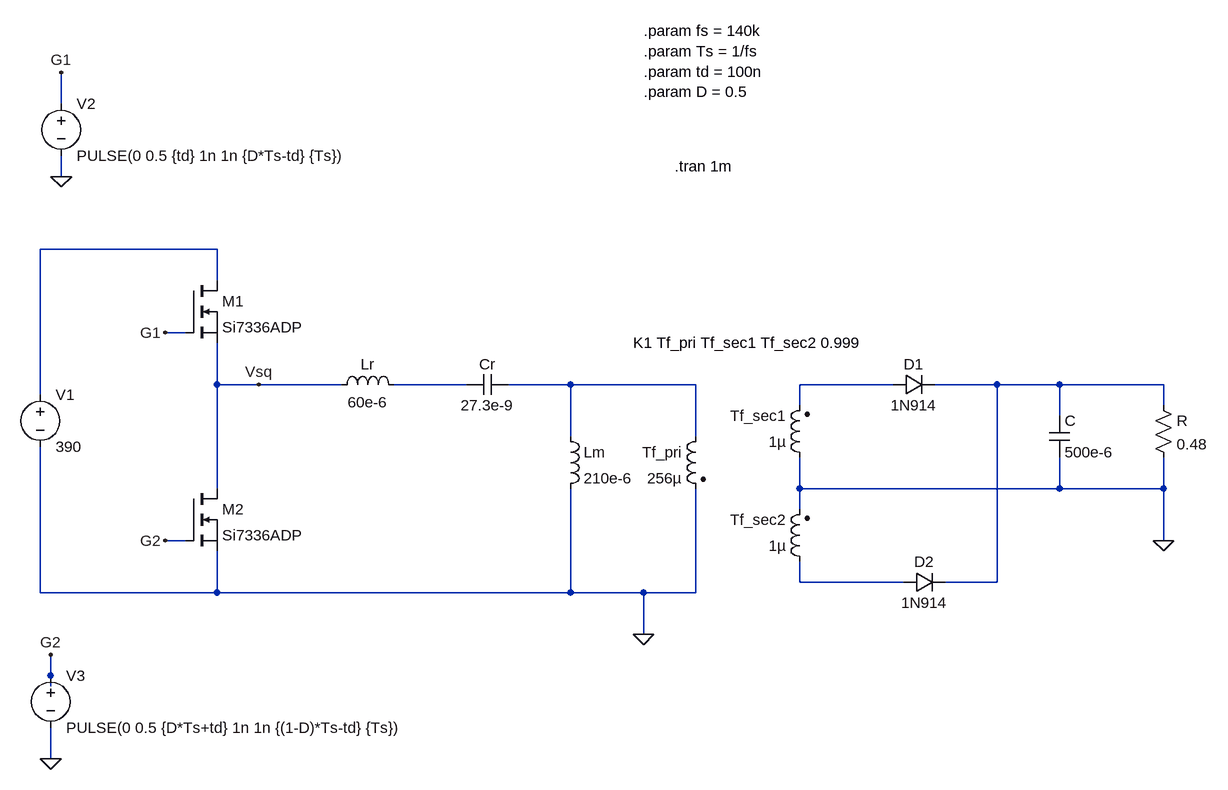
[diagram p0: schematic HalfBridge_LLC_TI.asc]
HalfBridge_LLC_TI.asc, the LTspice schematic file:
Version 4
SHEET 1 1708 728
WIRE -64 -320 -64 -368
WIRE -64 -208 -64 -240
WIRE 176 -96 -96 -96
WIRE 176 -48 176 -96
WIRE 128 32 96 32
WIRE 176 112 176 48
WIRE 240 112 176 112
WIRE 368 112 240 112
WIRE 560 112 448 112
WIRE 720 112 624 112
WIRE 912 112 720 112
WIRE 1216 112 1072 112
WIRE 1376 112 1280 112
WIRE 1472 112 1376 112
WIRE 1632 112 1472 112
WIRE -96 128 -96 -96
WIRE 1072 144 1072 112
WIRE 1632 144 1632 112
WIRE 1472 160 1472 112
WIRE 720 192 720 112
WIRE 912 192 912 112
WIRE 176 272 176 112
WIRE 1072 272 1072 224
WIRE 1472 272 1472 224
WIRE 1472 272 1072 272
WIRE 1632 272 1632 224
WIRE 1632 272 1472 272
WIRE 1072 304 1072 272
WIRE 128 352 96 352
WIRE 1632 352 1632 272
WIRE 1072 416 1072 384
WIRE 1232 416 1072 416
WIRE 1376 416 1376 112
WIRE 1376 416 1296 416
WIRE -96 432 -96 208
WIRE 176 432 176 368
WIRE 176 432 -96 432
WIRE 720 432 720 272
WIRE 720 432 176 432
WIRE 832 432 720 432
WIRE 912 432 912 272
WIRE 912 432 832 432
WIRE 832 496 832 432
WIRE -80 560 -80 528
WIRE -80 576 -80 560
WIRE -80 688 -80 640
FLAG 832 496 0
FLAG 1632 352 0
FLAG -64 -208 0
FLAG 96 32 G1
FLAG 96 352 G2
FLAG -64 -368 G1
FLAG -80 528 G2
FLAG -80 688 0
FLAG 240 112 Vsq
SYMBOL voltage -96 112 R0
WINDOW 123 0 0 Left 0
WINDOW 39 0 0 Left 0
SYMATTR InstName V1
SYMATTR Value 390
SYMBOL ind 352 128 R270
WINDOW 0 32 56 VTop 2
WINDOW 3 4 56 VBottom 2
SYMATTR InstName Lr
SYMATTR Value 60e-6
SYMBOL ind 704 176 R0
SYMATTR InstName Lm
SYMATTR Value 210e-6
SYMBOL ind2 928 176 M0
SYMATTR InstName Tf_pri
SYMATTR Value 256µ
SYMATTR Type ind
SYMBOL cap 560 128 R270
WINDOW 0 32 32 VTop 2
WINDOW 3 0 32 VBottom 2
SYMATTR InstName Cr
SYMATTR Value 27.3e-9
SYMBOL ind2 1088 240 R180
WINDOW 0 36 80 Left 2
WINDOW 3 36 40 Left 2
SYMATTR InstName Tf_sec1
SYMATTR Value 1µ
SYMATTR Type ind
SYMBOL ind2 1088 400 R180
WINDOW 0 36 80 Left 2
WINDOW 3 36 40 Left 2
SYMATTR InstName Tf_sec2
SYMATTR Value 1µ
SYMATTR Type ind
SYMBOL diode 1216 128 R270
WINDOW 0 32 32 VTop 2
WINDOW 3 0 32 VBottom 2
SYMATTR InstName D1
SYMATTR Value 1N914
SYMBOL diode 1232 432 R270
WINDOW 0 32 32 VTop 2
WINDOW 3 0 32 VBottom 2
SYMATTR InstName D2
SYMATTR Value 1N914
SYMBOL cap 1456 160 R0
SYMATTR InstName C
SYMATTR Value 500e-6
SYMBOL res 1616 128 R0
SYMATTR InstName R
SYMATTR Value 0.48
SYMBOL voltage -64 -336 R0
WINDOW 123 0 0 Left 0
WINDOW 39 0 0 Left 0
SYMATTR InstName V2
SYMATTR Value PULSE(0 0.5 {td} 1n 1n {D*Ts-td} {Ts})
SYMBOL voltage -80 544 R0
WINDOW 123 0 0 Left 0
WINDOW 39 0 0 Left 0
SYMATTR InstName V3
SYMATTR Value PULSE(0 0.5 {D*Ts+td} 1n 1n {(1-D)*Ts-td} {Ts})
SYMBOL nmos 128 -48 R0
SYMATTR InstName M1
SYMATTR Value Si7336ADP
SYMBOL nmos 128 272 R0
SYMATTR InstName M2
SYMATTR Value Si7336ADP
TEXT 816 48 Left 2 !K1 Tf_pri Tf_sec1 Tf_sec2 0.999
TEXT 832 -432 Left 2 !.param fs = 140k\n.param Ts = 1/fs\n.param td = 100n\n.param D = 0.5
TEXT 880 -224 Left 2 !.tran 1m

The netlist it stands for:
* HalfBridge_LLC_TI.asc
V1 N001 0 390
Lr Vsq N002 60e-6
Lm N003 0 210e-6
L§Tf_pri N003 0 256µ
Cr N002 N003 27.3e-9
L§Tf_sec1 0 N004 1µ
L§Tf_sec2 N006 0 1µ
D1 N004 N005 1N914
D2 N006 N005 1N914
C N005 0 500e-6
R N005 0 0.48
V2 G1 0 PULSE(0 0.5 {td} 1n 1n {D*Ts-td} {Ts})
V3 G2 0 PULSE(0 0.5 {D*Ts+td} 1n 1n {(1-D)*Ts-td} {Ts})
M1 N001 G1 Vsq Vsq Si7336ADP
M2 Vsq G2 0 0 Si7336ADP
.model D D
.lib standard.dio
.model NMOS NMOS
.model PMOS PMOS
.lib standard.mos
K1 Tf_pri Tf_sec1 Tf_sec2 0.999
.param fs = 140k
.param Ts = 1/fs
.param td = 100n
.param D = 0.5
.tran 1m
.backanno
.end